# EAGLE design touch_w_scroll (EAGLE 9.6.2)
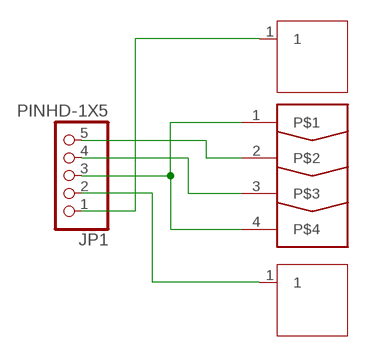
[diagram p0: schematic, sheet 1]

## Parts
JP1  PINHD-1X5  [1X05]
U$1  SLIDE_PAD  [SLIDE]
U$2  12X12_PAD  [12X12_PAD]
U$4  12X12_PADLED  [12X12_PAD_LED]

## Nets
N$1: JP1.1 U$2.1
N$2: JP1.2 U$4.1
N$3: JP1.3 U$1.1 U$1.4
N$4: JP1.4 U$1.3
N$5: JP1.5 U$1.2

## Library data of the parts
JP1 = Connector:PINHD-1X5: PIN HEADER; CATEGORY: CONNECTOR; SUB-CATEGORY: PIN-HEADER
U$1 = Cap Touch Pads:SLIDE_PAD
U$2 U$4 = Cap Touch Pads:12X12_PAD

## Board
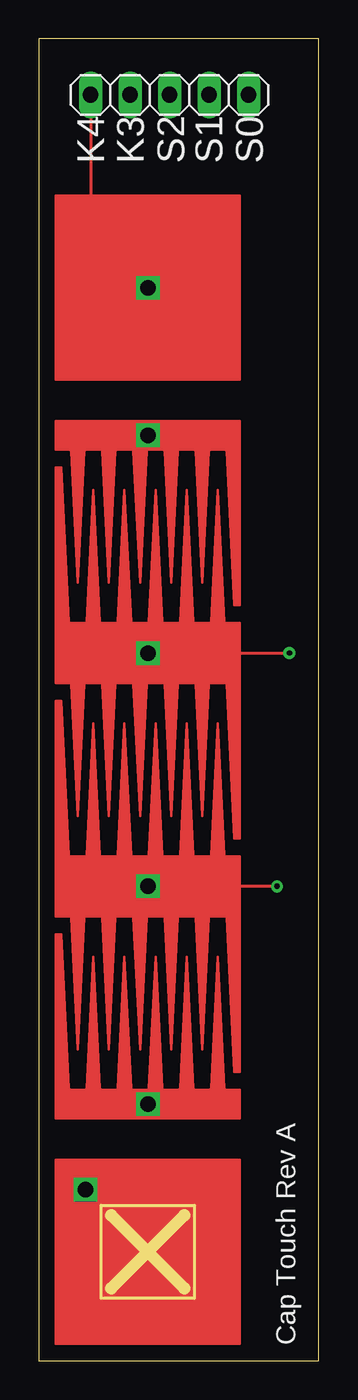
[diagram p1: board, top side]
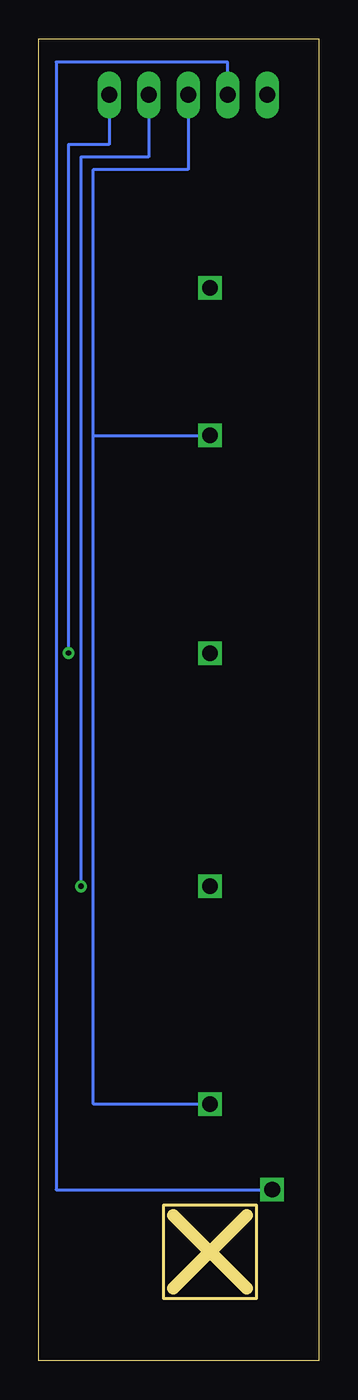
[diagram p2: board, bottom side, seen from below]

Size 18 x 85 mm. Coordinates in mm from the lower left corner, seen from the top.
Outline: 0,0 18,0 18,85 0,85 0,0
Outline: 4,10 10,10 10,4 4,4 4,10
Copper layers (1*16): Top 0.035mm / dielectric 1.5mm / Bottom 0.035mm
Design rules "default": minimum track width 6mil, minimum drill 0.35mm, track to track 6mil, track to pad 6mil, pad to pad 6mil, via to via 6mil, smd to smd 6mil, copper to edge 40mil, drill to drill 6mil, minimum pad ring 10mil, minimum via ring 8mil, stop-mask expansion 4mil, vias tented up to drill 0mil, thermal gap 10mil

### Footprints (pad centres in the part's own frame; a part is rotated, then mirrored left to right if it is on the bottom)
1X05 = drill 1.016 long: 1 -5.08,0; 2 -2.54,0; 3 0,0; 4 2.54,0; 5 5.08,0
SLIDE = drill 1 square: 1 1,-6; 2 15,-6; 3 30,-6; 4 44,-6
12X12_PAD = drill 1 square: 1 6,-6
12X12_PAD_LED = drill 1 square: 1 2,-2

### Placement (x,y rotation side)
JP1  8.4,81.4 0 top
U$1  13,60.5 270 top
U$2  1,75 0 top
U$4  1,13 0 top

### Tracks (layer width: path | path; a pad name or v marks a point on that pad's centre or on a via)
N$1
  Top 0.2: JP1.1 3.32,72.68 U$2.1
N$2
  Bottom 0.2: JP1.2 5.86,83.5 16.88,83.5 16.88,11 U$4.1
N$3
  Bottom 0.2: JP1.3 8.4,76.6 14.5,76.6 14.5,16.5 U$1.4 | 14.5,59.5 U$1.1
N$4  (via drill 0.35)
  Top 0.2: v15.3,30.5 U$1.3
  Bottom 0.2: JP1.4 10.94,77.4 15.3,77.4 v15.3,30.5
N$5  (via drill 0.35)
  Top 0.2: U$1.2 v16.1,45.5 v16.1,45.51
  Bottom 0.2: v16.1,45.51 16.1,78.2 13.48,78.2 JP1.5

### Text on the board
tNames: K4 | K3 | S2 | S1 | S0 | Cap Touch Rev A